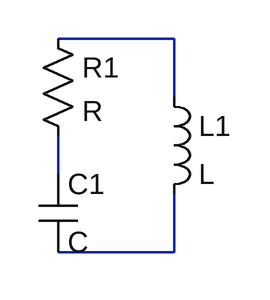
[diagram p0: schematic Basic Circuit.asc]
Basic Circuit.asc, the LTspice schematic file:
Version 4
SHEET 1 880 680
WIRE 160 48 64 48
WIRE 160 96 160 48
WIRE 64 160 64 128
WIRE 160 224 160 176
WIRE 160 224 64 224
SYMBOL res 48 32 R0
SYMATTR InstName R1
SYMBOL cap 48 160 R0
SYMATTR InstName C1
SYMBOL ind 144 80 R0
SYMATTR InstName L1

The netlist it stands for:
* Basic Circuit.asc
R1 N001 N002 R
C1 N002 N003 C
L1 N001 N003 L
.backanno
.end